# EAGLE design lightino (EAGLE 7.6.0)
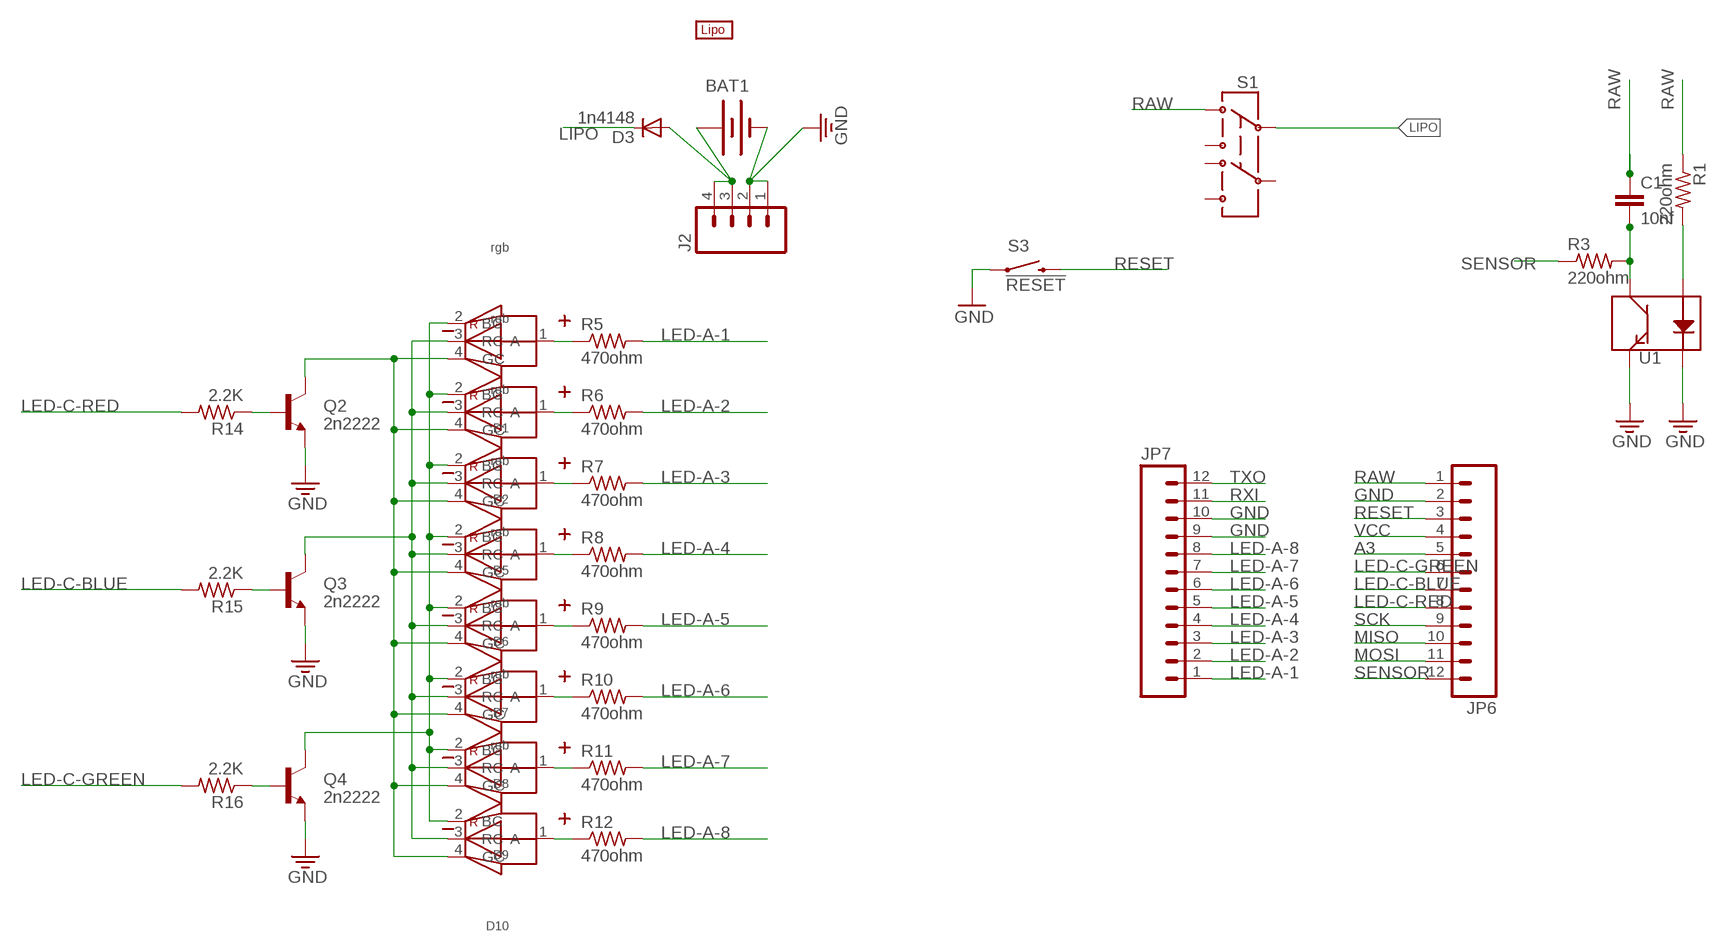
[diagram p0: schematic, sheet 1]

## Parts
BAT1  BATTERYLIPO-TABS  [LIPO-110-TABS]
C1  10nf  CAP0805  [0805]
D1  rgb  WL-SFTW-150141M173100-R&G&B  [3528-COMMON-ANODE]
D2  rgb  WL-SFTW-150141M173100-R&G&B  [3528-COMMON-ANODE]
D3  1n4148  DIODESOD  [SOD-323]
D5  rgb  WL-SFTW-150141M173100-R&G&B  [3528-COMMON-ANODE]
D6  rgb  WL-SFTW-150141M173100-R&G&B  [3528-COMMON-ANODE]
D7  rgb  WL-SFTW-150141M173100-R&G&B  [3528-COMMON-ANODE]
D8  rgb  WL-SFTW-150141M173100-R&G&B  [3528-COMMON-ANODE]
D9  rgb  WL-SFTW-150141M173100-R&G&B  [3528-COMMON-ANODE]
D10  rgb  WL-SFTW-150141M173100-R&G&B  [3528-COMMON-ANODE]
J2  M041.27MM  [1X04-1.27MM]
JP6  M12PTH  [1X12]
JP7  M12PTH  [1X12]
Q2  2n2222  TRANSISTOR_NPNSOT23  [SOT23]
Q3  2n2222  TRANSISTOR_NPNSOT23  [SOT23]
Q4  2n2222  TRANSISTOR_NPNSOT23  [SOT23]
R1  220ohm  R-US_M0805  [M0805]
R3  220ohm  R-US_M0805  [M0805]
R5  470ohm  R-US_M0805  [M0805]
R6  470ohm  R-US_M0805  [M0805]
R7  470ohm  R-US_M0805  [M0805]
R8  470ohm  R-US_M0805  [M0805]
R9  470ohm  R-US_M0805  [M0805]
R10  470ohm  R-US_M0805  [M0805]
R11  470ohm  R-US_M0805  [M0805]
R12  470ohm  R-US_M0805  [M0805]
R14  2.2K  R-US_M0805  [M0805]
R15  2.2K  R-US_M0805  [M0805]
R16  2.2K  R-US_M0805  [M0805]
S1  SWITCH-DPDTAYZ0202  [AYZ0202]
S3  !RESET  SWITCH-MOMENTARY-2SMD  [TACTILE_SWITCH_SMD]
U1  QRE1113SMD-W  [QRE1113-W]
U$1  LIPO-OUTLINE100  [LIPO-100]

## Nets
A3: JP6.5
GND: BAT1.- J2.1 J2.2 JP6.2 JP7.9 JP7.10 Q2.2(E) Q3.2(E) Q4.2(E) S3.1 U1.2(K) U1.4(E)
LED-A-1: JP7.1 R5.2
LED-A-2: JP7.2 R6.2
LED-A-3: JP7.3 R7.2
LED-A-4: JP7.4 R8.2
LED-A-5: JP7.5 R9.2
LED-A-6: JP7.6 R10.2
LED-A-7: JP7.7 R11.2
LED-A-8: JP7.8 R12.2
LED-C-BLUE: JP6.7 R15.2
LED-C-GREEN: JP6.6 R16.2
LED-C-RED: JP6.8 R14.2
LIPO: D3.1(C) S1.2
MISO: JP6.10
MOSI: JP6.11
N$1: BAT1.+ D3.2(A) J2.3 J2.4
N$3: R1.2 U1.1(A)
N$5: D2.1(A) R6.1
N$6: D1.1(A) R5.1
N$10: D10.1(A) R12.1
N$11: D9.1(A) R11.1
N$12: D8.1(A) R10.1
N$13: D7.1(A) R9.1
N$14: D6.1(A) R8.1
N$15: D5.1(A) R7.1
N$16: D1.2(BC) D2.2(BC) D5.2(BC) D6.2(BC) D7.2(BC) D8.2(BC) D9.2(BC) D10.2(BC) Q4.3(C)
N$17: D1.3(RC) D2.3(RC) D5.3(RC) D6.3(RC) D7.3(RC) D8.3(RC) D9.3(RC) D10.3(RC) Q3.3(C)
N$18: D1.4(GC) D2.4(GC) D5.4(GC) D6.4(GC) D7.4(GC) D8.4(GC) D9.4(GC) D10.4(GC) Q2.3(C)
N$19: Q2.1(B) R14.1
N$20: Q3.1(B) R15.1
N$21: Q4.1(B) R16.1
RAW [vcc]: C1.1 JP6.1 R1.1 S1.1
RESET: JP6.3 S3.3
RXI: JP7.11
SCK: JP6.9
SENSOR: JP6.12 R3.1
TXO: JP7.12
VCC: JP6.4
XX: C1.2 R3.2 U1.3(C)
Unconnected: S1.3 S1.4 S1.5 S1.6

## Library data of the parts
BAT1 = SparkFun-Electromechanical:BATTERY: Battery Holders Various common sizes : AA, AAA, 18650 (PRT-12895), 20mm coin cell and 12mm coin cell. 20MM_4LEGS, BATT-10373
C1 = SparkFun-Capacitors:CAP: Capacitor Standard 0603 ceramic capacitor, and 0.1" leaded capacitor.
D1 D2 D5-D10 = Wurth_Elektronik_Optoelectronics_rev15b:WL-SFTW: SMD full-color TOP LED Characteristics Low energy consumption High reliability Low current requirement Fast switching No UV/IR radiation High brightness RGB individual control Compact package outline Black surface Applications Flash light Switch indicators Equipments indicators Accent and decorative lighting Electronic signage Video displays Backlight for LCDs, PDAs and TVs Oven, microwave Street lighting Ideal for lateral coupling in light guides <http://katalog.we-online.de/media/images/eipal/WL-SFTW_pf2.jpg> Details see: http://katalog.we-online.de/en/led/WL-SFTW?m Updated 2015-04-10 2015 (C) Wurth Elektronik
D3 = SparkFun:DIODE: Diode These are standard reverse protection diodes and small signal diodes. SMA package can handle up to about 1A. SOD-323 can handle about 200mA. What the SOD-323 package when ordering, there are some mfgs out there that are 5-pin packages.
J2 = SparkFun-Connectors:M04: Header 4 Standard 4-pin 0.1" header. Use with straight break away headers (SKU : PRT-00116), right angle break away headers (PRT-00553), swiss pins (PRT-00743), machine pins (PRT-00117), and female headers (PRT-00115). Molex polarized connector foot print use with SKU : PRT-08231 with associated crimp pins and housings. 1MM SMD Version SKU: PRT-10208
JP6 JP7 = SparkFun:M12: Header 12 Standard 12-pin 0.1" header. Use with straight break away headers (SKU : PRT-00116), right angle break away headers (PRT-00553), swiss pins (PRT-00743), machine pins (PRT-00117), and female headers (PRT-00115).
Q2-Q4 = minipov4:TRANSISTOR_NPN: Transistor NPN BJT configuration in SOT23 package. MMBT2222 is the common NPN we use. Double check BCE configuration again layout.
R1 R3 R5-R12 R14-R16 = adafruit:R-US_: RESISTOR, American symbol
S1 = SparkFun-Electromechanical:SWITCH-DPDT: DPDT Version of the COM-00597; PROD_ID: SWCH-08179; VALUE: DPDT
S3 = SparkFun-Electromechanical:SWITCH-MOMENTARY-2: Various NO switches- pushbuttons, reed, etc; PROD_ID: SWCH-08247
U1 = SparkFun-Sensors:QRE1113: Reflective object sensor
U$1 = SparkFun-Electromechanical:LIPO-OUTLINE: Outlines for common LiPo batteries sold by SparkFun. For fit only- no pads or connectors!

## Net classes
0 default: width 0.203 mm
2 motors: width 1.016 mm

## Board
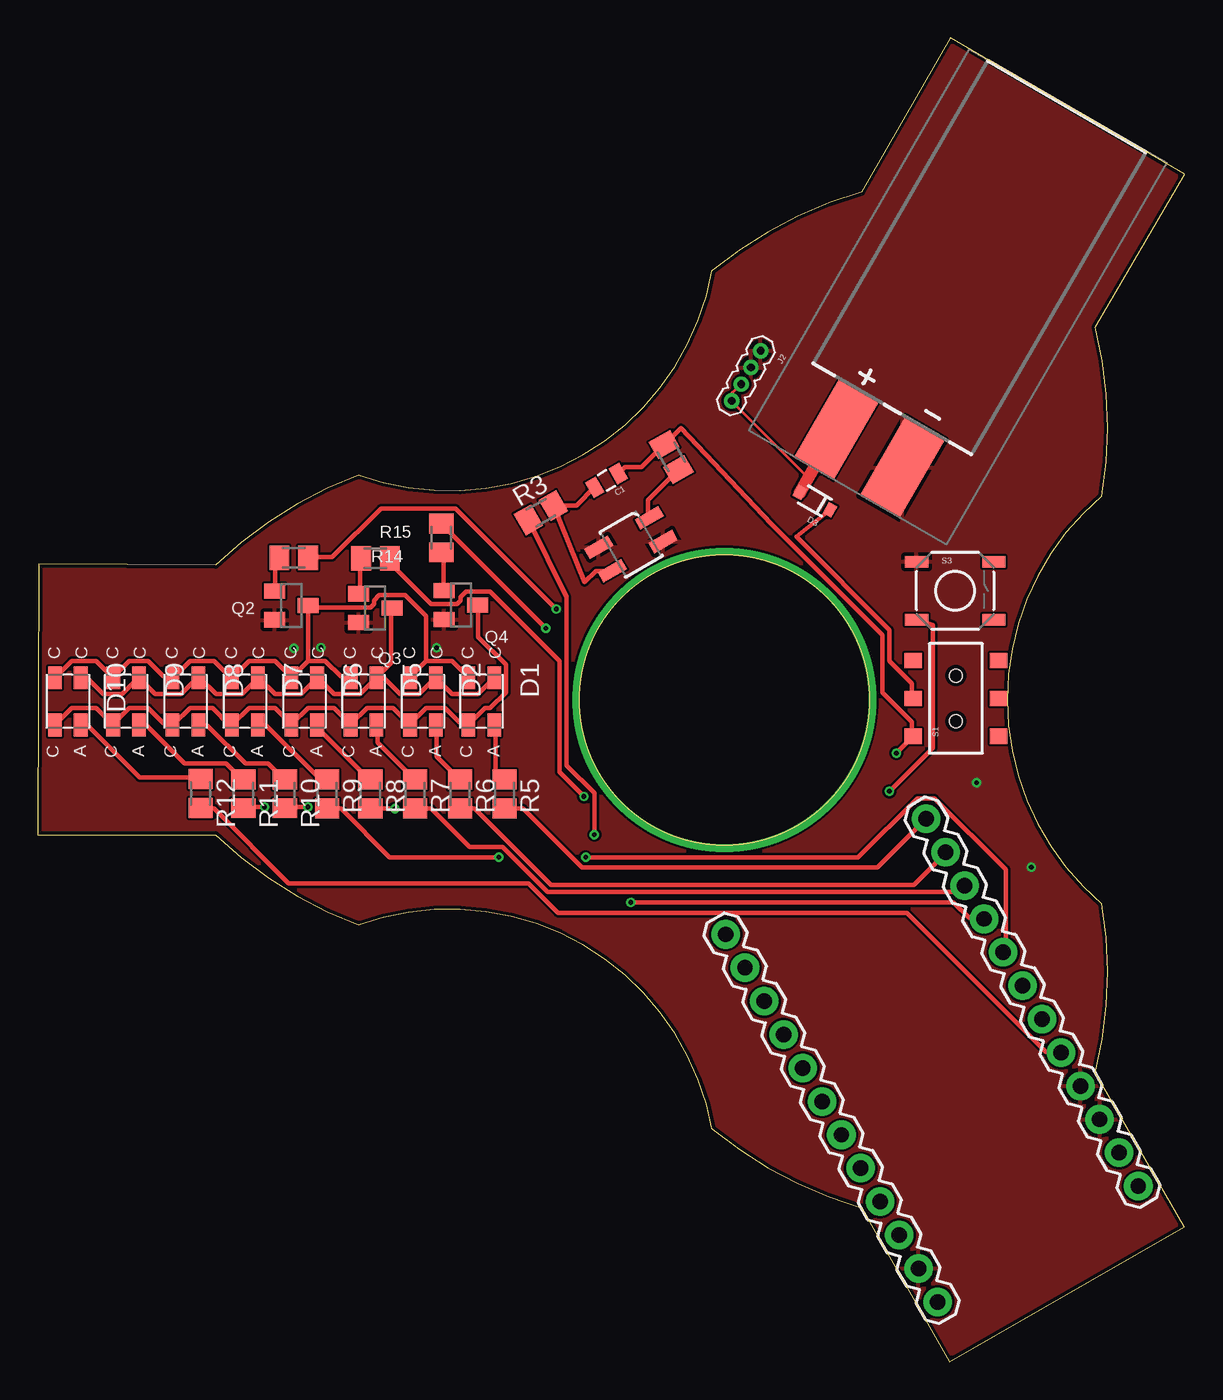
[diagram p1: board, top side]
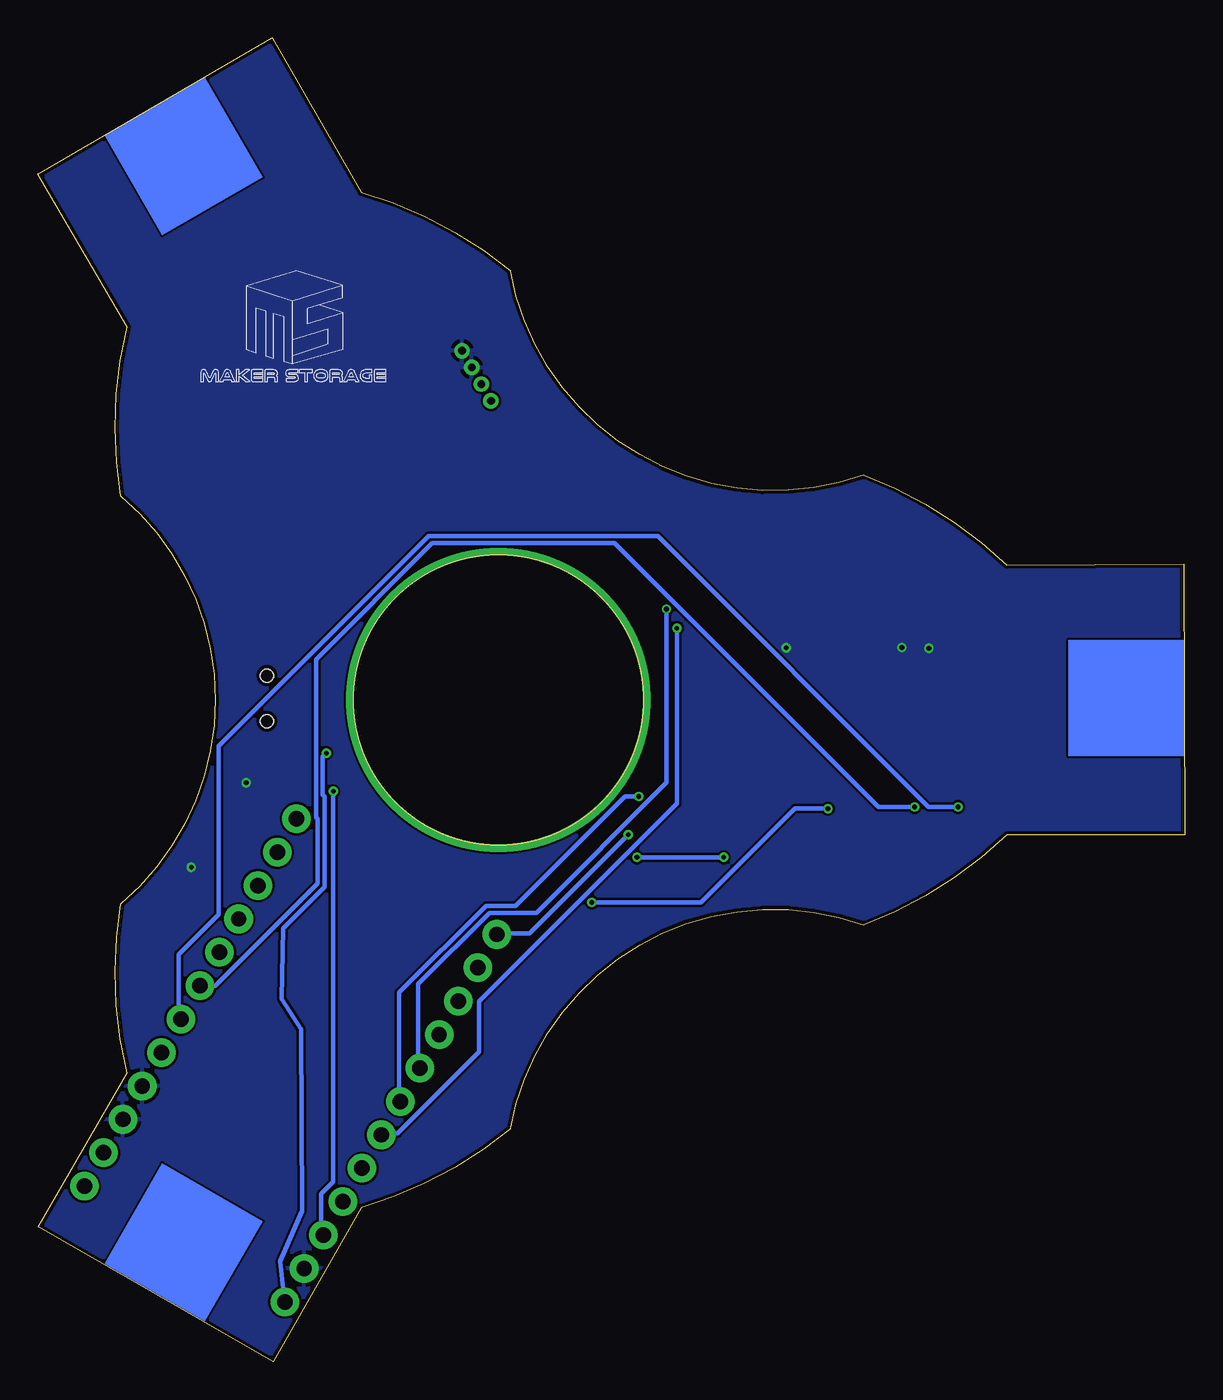
[diagram p2: board, bottom side, seen from below]

Size 75.52 x 87.16 mm. Coordinates in mm from the lower left corner, seen from the top.
Outline: 21.13,58.39 arc23 11.72,52.46 0.05,52.51 0,34.68 11.72,34.68 arc23 21.13,28.75 arc-100 44.4,15.32 arc23 54.24,10.13 60.03,0 75.5,8.87 69.64,19.02 arc23 70.07,30.14 arc-100 70.07,57 arc23 69.64,68.12 75.52,78.2 60.1,87.16 54.24,77.01 arc23 44.4,71.82 arc-100 21.13,58.39
Outline: circle at 45.2,43.57 radius 9.55
Copper layers (1*16): Top 0.035mm / dielectric 1.5mm / Bottom 0.035mm
Design rules "SeeedStudio_2layer_DRU_no_angle_20140221": minimum track width 6mil, minimum drill 12mil, track to track 6mil, track to pad 6mil, pad to pad 6mil, via to via 6mil, smd to smd 0mil, copper to edge 10mil, drill to drill 10mil, minimum pad ring 10mil, minimum via ring 6mil, stop-mask expansion 2mil, vias tented up to drill 100mil, thermal gap 10mil

### Footprints (pad centres in the part's own frame; a part is rotated, then mirrored left to right if it is on the bottom)
LIPO-110-TABS = smd 3 x 6: + 2.5,14.5; - -2.5,14.5
0805 = smd 0.8 x 1.2: 1 -0.9,0; 2 0.9,0
3528-COMMON-ANODE = smd 1.5 x 0.9: 1 1.55,0.85; 2 1.55,-0.85; 3 -1.55,0.85; 4 -1.55,-0.85
SOD-323 = smd 0.63 x 0.83: 1 -1.15,0; 2 1.15,0
1X04-1.27MM = drill 0.508 pad 1: 1 0,0; 2 1.27,0; 3 2.54,0; 4 3.81,0
1X12 = drill 1.016 pad 1.88: 1 0,0; 2 2.54,0; 3 5.08,0; 4 7.62,0; 5 10.16,0; 6 12.7,0; 7 15.24,0; 8 17.78,0; 9 20.32,0; 10 22.86,0; 11 25.4,0; 12 27.94,0
SOT23 = smd 1 x 1.4: 1 -0.95,-1.1; 2 0.95,-1.1; 3 0,1.1
M0805 = smd 1.3 x 1.6: 1 -0.95,0; 2 0.95,0
AYZ0202 = smd 1 x 1.15: 1 -2.5,2.825; 2 0,2.825; 3 2.5,2.825; 4 -2.5,-2.825; 5 0,-2.825; 6 2.5,-2.825 | hole 0.85: 1.5,0; -1.5,0
TACTILE_SWITCH_SMD = smd 1.524 x 0.762: 1 -2.54,1.905; 2 2.54,1.905; 3 -2.54,-1.905; 4 2.54,-1.905
QRE1113-W = smd 1.778 x 0.762: 1 -1.927,-0.9; 2 1.927,-0.9; 3 1.927,0.9; 4 -1.927,0.9

### Placement (x,y rotation side)
BAT1  62.01,72.69 150 top
C1  37.44,58.02 210 top
D1  29.2,43.48 270 top
D2  25.35,43.48 270 top
D3  51.16,56.66 150 top
D5  21.44,43.48 270 top
D6  17.53,43.48 270 top
D7  13.62,43.48 270 top
D8  9.72,43.48 270 top
D9  5.81,43.48 270 top
D10  1.97,43.48 270 top
J2  47.59,66.57 240 top
JP6  59.26,3.93 120 top
JP7  58.49,35.75 300 top
Q2  16.69,49.79 270 top
Q3  22.21,49.61 270 top
Q4  27.85,49.82 270 top
R1  41.71,59.57 300 top
R3  33.12,55.9 30 top
R5  30.73,37.38 270 top
R6  27.79,37.38 270 top
R7  24.83,37.38 270 top
R8  21.88,37.38 270 top
R9  19.04,37.38 270 top
R10  16.27,37.38 270 top
R11  13.53,37.38 270 top
R12  10.71,37.41 270 top
R14  16.84,52.94 0 top
R15  22.23,52.89 0 top
R16  26.56,54.23 90 top
S1  60.45,43.67 90 top
S3  60.4,50.76 0 top
U1  39.05,53.81 210 top
U$1  59.83,53.82 60 top

### Tracks (layer width: path | path; a pad name or v marks a point on that pad's centre or on a via)
GND  (via drill 0.3)
  other vias: 16.85,46.97 18.63,47.02 26.25,47.01 61.81,38.12 65.42,32.55
  pour Top: -16.27,-10.64 -4.61,89.87 90.39,88.87 90.39,-6.98 -0.07,-8.02
  pour Bottom: -20.73,0.14 93.16,-7.21 94.43,93.37 -10.57,94.37
LED-A-1
  Top 0.305: R5.2 30.81,36.41 31.95,36.41 35.84,32.52 55.27,32.52 58.47,35.72 JP7.1
LED-A-2
  Top 0.305: R6.2 27.84,36.41 28.75,36.41 33.78,31.38 57.67,31.38 59.73,33.44 JP7.2
LED-A-3
  Top 0.305: R7.2 24.87,36.41 25.9,36.41 28.41,33.89 30.58,33.89 33.56,30.92 60.64,30.92 60.99,31.27 JP7.3
LED-A-4  (via drill 0.3)
  Top 0.305: v23.5,36.41 21.9,36.41 R8.2 | v39.04,30.24 60.3,30.24 61.33,29.21 62.24,29.21 JP7.4
  Bottom 0.305: v23.5,36.41 25.67,36.41 31.84,30.24 v39.04,30.24
LED-A-5  (via drill 0.3)
  Top 0.305: v30.35,33.21 23.15,33.21 19.95,36.41 19.15,36.41 R9.2 | v36.07,33.21 54.01,33.21 57.9,37.09 59.04,37.09 63.73,32.41 63.73,27.15 63.62,27.04 JP7.5
  Bottom 0.305: v36.07,33.21 v30.35,33.21
LED-A-6  (via drill 0.3)
  Top 0.305: v17.78,36.52 16.3,36.52 R10.2
  Bottom 0.305: v17.78,36.52 20.18,36.52 37.56,53.9 49.56,53.9 57.22,46.24 57.22,35.84 57.1,35.72 57.1,31.49 63.84,24.75 64.76,24.75 JP7.6
LED-A-7  (via drill 0.3)
  Top 0.305: v14.92,36.52 13.55,36.52 R11.2
  Bottom 0.305: v14.92,36.52 16.87,36.52 34.7,54.35 49.79,54.35 63.62,40.52 63.62,29.44 66.24,26.81 66.24,22.69 66.13,22.58 JP7.7
LED-A-8
  Top 0.305: R12.2 10.81,36.41 11.61,36.41 16.52,31.49 32.3,31.49 34.24,29.55 57.22,29.55 66.36,20.41 67.27,20.41 JP7.8
LED-C-BLUE  (via drill 0.3)
  Top 0.305: v35.96,37.21 34.36,38.81 34.36,46.12 29.78,50.7 28.18,50.7 27.84,50.35 27.84,50.12 27.61,49.9 25.9,49.9 23.27,52.53 23.27,52.87 R15.2
  Bottom 0.305: v35.96,37.21 36.87,37.21 44.07,30.01 46.01,30.01 51.73,24.29 51.73,17.21 JP6.7
LED-C-GREEN  (via drill 0.3)
  Top 0.305: v33.44,48.3 26.58,55.15 R16.2
  Bottom 0.305: v33.44,48.3 33.44,36.75 46.47,23.72 46.47,20.41 51.84,15.03 52.87,15.03 JP6.6
LED-C-RED  (via drill 0.3)
  Top 0.305: v34.13,49.55 27.5,56.18 22.58,56.18 19.38,52.98 17.9,52.98 R14.2
  Bottom 0.305: v34.13,49.55 34.13,38.12 42.7,29.55 45.79,29.55 50.47,24.86 50.47,19.38 JP6.8
LIPO
  Top 0.305: S1.2 57.56,43.72 57.56,44.64 56.07,46.12 56.07,48.18 49.94,54.32 D3.1
N$1
  Top 0.203: J2.3 46.26,64.35 45.72,63.82 45.72,63.28 J2.4 45.72,63.19 50.43,58.48 50.78,58.28
  Top 0.813: D3.2 50.78,58.28 BAT1.+
N$3
  Top 0.305: U1.1 40.18,55.61 40.18,56.74 R1.2
N$5
  Top 0.305: D2.1 26.24,41.9 26.24,39.84 27.73,38.35 R6.1
N$6
  Top 0.305: D1.1 30.13,41.9 30.13,38.92 30.7,38.35 R5.1
N$10
  Top 0.305: D10.1 2.92,41.9 3.27,41.9 6.69,38.47 10.7,38.47 R12.1
N$11
  Top 0.305: D9.1 6.69,41.9 7.15,41.9 9.67,39.38 12.41,39.38 13.44,38.35 R11.1
N$12
  Top 0.305: D8.1 10.58,41.9 11.15,41.9 13.67,39.38 15.15,39.38 16.18,38.35 R10.1
N$13
  Top 0.305: D7.1 14.58,41.9 15.04,41.9 18.58,38.35 19.04,38.35 R9.1
N$14
  Top 0.305: D6.1 18.47,41.9 18.47,41.67 21.78,38.35 R8.1
N$15
  Top 0.305: D5.1 22.35,41.9 22.35,40.75 24.75,38.35 R7.1
N$16
  Top 0.305: Q4.3 28.98,49.78 28.98,47.72 30.81,45.9 30.81,44.07 29.78,43.04 29.44,43.04 28.41,42.01 D1.2 28.3,42.01 27.84,42.01 26.81,43.04 25.55,43.04 24.53,42.01 D2.2 24.41,42.01 23.38,43.04 21.67,43.04 20.64,42.01 D5.2 20.52,42.01 19.5,43.04 17.78,43.04 16.75,42.01 D6.2 16.64,42.01 15.61,43.04 13.9,43.04 12.87,42.01 D7.2 12.64,41.9 11.5,43.04 10.01,43.04 8.98,42.01 D8.2 8.75,42.01 8.29,42.01 7.27,43.04 6.01,43.04 4.98,42.01 D9.2 4.87,42.01 3.84,43.04 2.24,43.04 1.21,42.01 D10.2
N$17
  Top 0.305: Q3.3 23.27,49.55 23.27,46.01 22.35,45.1 D5.3 | D5.3 22.58,45.21 23.84,43.95 25.1,43.95 26.13,44.98 D2.3 26.24,44.98 27.27,43.95 28.98,43.95 30.01,44.98 D1.3 | D10.3 2.92,44.98 3.27,44.98 4.29,43.95 5.55,43.95 6.58,44.98 D9.3 6.69,44.98 7.72,43.95 9.44,43.95 10.47,44.98 D8.3 10.7,44.98 11.72,43.95 13.44,43.95 14.47,44.98 D7.3 14.58,44.98 15.61,43.95 17.32,43.95 18.35,44.98 D6.3 18.47,44.98 19.5,43.95 21.21,43.95 22.24,44.98 D5.3
N$18
  Top 0.305: D10.4 1.21,45.1 2.24,46.12 3.84,46.12 4.87,45.1 D9.4 4.98,45.1 6.01,46.12 7.27,46.12 8.29,45.1 8.75,45.1 D8.4 8.98,45.1 10.01,46.12 11.61,46.12 12.64,45.1 D7.4 12.87,45.1 13.9,46.12 15.61,46.12 16.64,45.1 D6.4 16.75,45.1 17.78,46.12 | 25.55,46.12 24.53,45.1 D2.4 | 25.55,46.12 27.27,46.12 28.3,45.1 D1.4 | 17.78,46.12 17.78,49.78 Q2.3 17.9,49.67 21.9,49.67 22.13,49.9 22.13,50.12 22.47,50.47 24.18,50.47 25.55,49.1 25.55,46.12 | 17.78,46.12 18.92,46.12 19.95,45.1 20.52,45.1 D5.4
N$19
  Top 0.305: Q2.1 15.61,50.81 15.61,52.64 15.84,52.87 R14.1
N$20
  Top 0.305: Q3.1 21.21,50.58 21.21,52.87 R15.1
N$21
  Top 0.305: Q4.1 26.7,50.81 26.7,53.1 26.58,53.21 R16.1
RAW  (via drill 0.3)
  Top 0.305: v56.53,40.07 57.56,41.1 S1.1 57.56,41.21 57.56,42.12 55.61,44.07 55.61,47.84 48.3,55.15 42.34,61.48 R1.1 39.75,58.9 38.65,58.9 C1.1
  Bottom 0.305: v56.53,40.07 56.76,39.84 56.76,37.32 56.64,37.21 56.64,31.27 59.39,28.52 59.47,23.88 58.2,21.86 58.12,9.93 59.57,6.59 59.27,3.95 JP6.1
RESET  (via drill 0.3)
  Top 0.305: v56.07,37.55 58.93,40.41 58.93,48.5 S3.3
  Bottom 0.305: v56.07,37.55 56.07,11.83 56.87,11.03 56.87,8.52 56.76,8.41 JP6.3
S$1  (via drill 19 pad 19)
  other vias: 45.2,43.57
SENSOR  (via drill 0.3)
  Top 0.305: v36.64,34.69 36.64,37.44 34.81,39.27 34.81,50.35 R3.1
  Bottom 0.305: v36.64,34.69 43.16,28.18 45.21,28.18 JP6.12
XX
  Top 0.305: U1.3 36.75,52.07 35.99,51.32 R3.2 35.46,56.38 C1.2
(copper drawn outside any net)
  shapes: Bottom area x3